# Altium schematic sheet Power Management.SchDoc: Power Management
size 228 x 165 mm; DrawnBy: Joseph Riesen; DocumentNumber: 4; Revision: 1.0; SheetNumber: 4; SheetTotal: 10
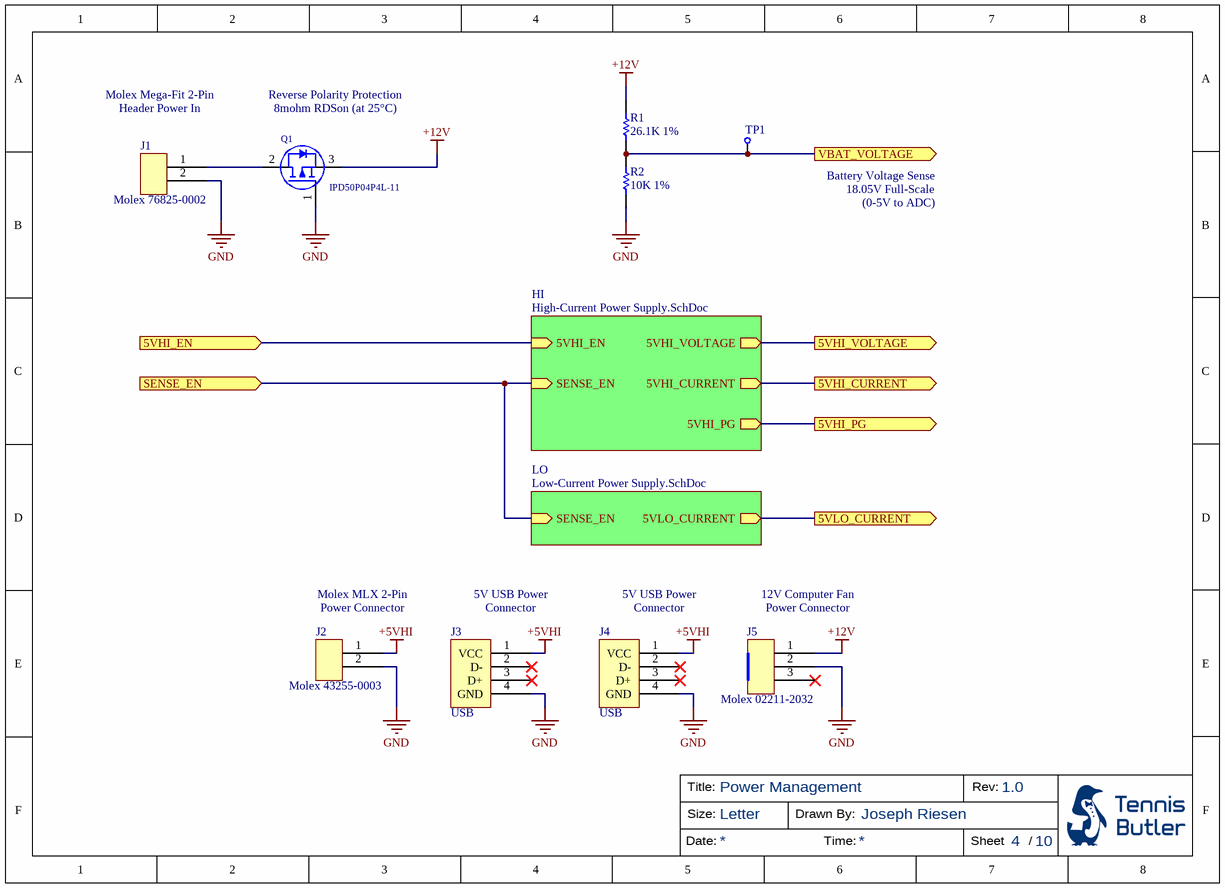
[diagram p0: Power Management.SchDoc]

## Parts
J1  Molex 76825-0002  [MOLEX 76825-0002]
J2  Molex 43255-0003  [Molex 43255-0003]
J3  USB  [Molex 105057-0001]
J4  USB  [Molex 105057-0001]
J5  Molex 02211-2032  [Molex 02211-2032]
Q1  IPD50P04P4L-11  [DPAK228P1000X235-3M]
R1  26.1K 1%  [RESC0805(2012)_M]
R2  10K 1%  [RESC2013X70X40ML20T20]
TP1  VBAT VOLTAGE  [Test Point]  (value not drawn)  (no BOM)

## Sub-sheets
HI = High-Current Power Supply.SchDoc: 5VHI_EN (in), 5VHI_CURRENT (out), SENSE_EN (in), 5VHI_PG (out), 5VHI_VOLTAGE (out)
LO = Low-Current Power Supply.SchDoc: 5VLO_CURRENT (out), SENSE_EN (in)

## Ports
5VHI_CURRENT (out), 5VHI_EN (in), 5VHI_PG (out), 5VHI_VOLTAGE (out), 5VLO_CURRENT (out), SENSE_EN (in), VBAT_VOLTAGE (out)

## Nets
+5VHI: J2.1 J3.1(VCC) J4.1(VCC)
+12V: J5.1 Q1.3 R1.2
GND: J1.2 J2.2 J3.4(GND) J4.4(GND) J5.2 Q1.1 R2.1
5VHI_CURRENT: port 5VHI_CURRENT, sheet HI/5VHI_CURRENT
5VHI_EN: port 5VHI_EN, sheet HI/5VHI_EN
5VHI_PG: port 5VHI_PG, sheet HI/5VHI_PG
5VHI_VOLTAGE: port 5VHI_VOLTAGE, sheet HI/5VHI_VOLTAGE
5VLO_CURRENT: port 5VLO_CURRENT, sheet LO/5VLO_CURRENT
SENSE_EN: port SENSE_EN, sheet HI/SENSE_EN, sheet LO/SENSE_EN
VBAT_VOLTAGE: R1.1 R2.2 TP1.1 ; port VBAT_VOLTAGE
NetJ1_1: J1.1 Q1.2

Not connected (* = marked no-connect by the designer): J3 2(D-)* 3(D+)* 5(GND) 6(GND) 7(GND); J4 2(D-)* 3(D+)* 5(GND) 6(GND) 7(GND); J5 3*

## Notes on the sheet
- (near J1) Molex Mega-Fit 2-Pin
  Header Power In
- (near Q1) Reverse Polarity Protection
  8mohm RDSon (at 25°C)
- Battery Voltage Sense
  18.05V Full-Scale
  (0-5V to ADC)
- (near J2) Molex MLX 2-Pin Power Connector
- (near J3) 5V USB Power Connector
- (near J4) 5V USB Power Connector
- (near J5) 12V Computer Fan Power Connector
- Title:
- Size:
- Letter
- Drawn By:
- Rev:
- Date:
- Time:
- Sheet
- /

## Library data of the parts
J1 = Molex 76825-0002: CONN HEADER R/A 2POS; Number of Circuits: 2; Gender: Male; Pitch: 5.7mm; Supplier 1: Digi-Key; Manufacturer: Molex; Manufacturer Part Number: 76825-0002; Stock 1: 2541; Pricing 1: 1 = 1.13000, 10 = 0.99300, 25 = 0.93440, 50 = 0.89560, 100 = 0.85670, 250 = 0.77880, 500 = 0.70092, 2016 = 0.58410, 4032 = 0.56463 (USD); RoHS: Yes; Color: Black; Contact Plating: Tin; Contact Material: Copper; Termination: Through Hole; Number of Rows: 2; Orientation: Right Angle; Number of Contacts: 2; REACH SVHC: Unknown; ComponentLink1URL: http://www.farnell.com/datasheets/2216551.pdf?src-supplier=Farnell; ComponentLink1Description: Datasheet 1 (Farnell); ComponentLink2URL: http://www.alliedelec.com/images/products/datasheets/bm/BrandonData/70717238.pdf?src-supplier=Allied+Electronics; ComponentLink2Description: Datasheet 2 (Allied Electronics); ComponentLink3URL: https://www.molex.com/pdm_docs/sd/768250002_sd.pdf?src-supplier=Digi-Key; ComponentLink3Description: Datasheet 3 (Digi-Key); ComponentLink4URL: http://www.farnell.com/datasheets/2001779.pdf?src-supplier=Element14; ComponentLink4Description: Datasheet 4 (Element14); ComponentLink5URL: http://www.farnell.com/datasheets/1968956.pdf?src-supplier=Element14; ComponentLink5Description: Datasheet 5 (Element14); Supplier Part Number 1: WM11969-ND
J2 = Molex 43255-0003: Pin & Socket Connectors 0.084 MLX Hdr 2CKT WITH PEG; Current Rating: 20A; Voltage Rating: 600V; Number of Positions: 2; Pitch: 6.35mm; Glow Wire Compliant: Non-compliant; Supplier 1: Digi-Key; Manufacturer: Molex; Manufacturer Part Number: 43255-0003; Stock 1: 7344; Pricing 1: 1 = 0.46000, 10 = 0.43200, 100 = 0.33140, 500 = 0.28820, 1836 = 0.23056, 5508 = 0.20895, 11016 = 0.19454 (USD); RoHS 1: Yes; Mount: Through Hole; Contact Material: Bronze; Contact Plating: Tin; Housing Material: Polyester; Min Operating Temperature: -55°C; Max Operating Temperature: 105°C; Package Quantity: 1836; Number of Rows: 1; Contact Gender: Male; Packaging: Tray; Termination: Through Hole; Number of Contacts: 2; Orientation: Straight; Number of Circuits: 2; REACH SVHC: No SVHC; Flammability Rating: UL94 V-0; ComponentLink1URL: https://datasheet.ciiva.com/30153/7750432550003-pcb-headers-30153428.pdf?src-supplier=Onlinecomponents.com; ComponentLink1Description: Datasheet 1 (Onlinecomponents.com); ComponentLink2URL: https://datasheet.ciiva.com/12919/0432550003-pcb-headers-168374-12919417.pdf?src-supplier=Mouser; ComponentLink2Description: Datasheet 2 (Mouser); Supplier Part Number 1: WM23264-ND
J3 J4 = Molex 105057-0001: CONN RCPT USB2.0 TYPEA 4POS VERT; Manufacturer: Molex; Gender: Receptacle; Number of Ports: 1; Number of Contacts: 4; Current Rating: 1.5A; Voltage Rating: 30V; Pitch: 2mm; Supplier 1: Digi-Key; Manufacturer Part Number: 105057-0001; Stock 1: 43852; Pricing 1: 1 = 1.29000, 10 = 1.13600, 25 = 1.06880, 50 = 1.02440, 100 = 0.97990, 250 = 0.89080, 500 = 0.80172, 2016 = 0.66810, 4032 = 0.64583 (USD); RoHS 1: Yes; Mount: Through Hole; Contact Plating: Gold; Contact Material: Copper Alloy; Number of Terminals: 4; Housing Material: Thermoplastic; Color: Black; Min Operating Temperature: -40°C; Max Operating Temperature: 85°C; Packaging: Tray; Package Quantity: 2016; Connector Type: USB; Termination: Solder; Orientation: Vertical; Features: Shielded; Number of Positions: 4; Number of Circuits: 4; USB Standard: USB 2.0; Length: 14.68mm; Depth: 14.3mm; Radiation Hardening: No; REACH SVHC: Unknown; ComponentLink1URL: https://datasheet.ciiva.com/3094/1050570001-io-connectors-3094352.pdf?src-supplier=Avnet; ComponentLink1Description: https://datasheet.ciiva.com/3094/1050570001-io-connectors-3094352.pdf?src-supplier=Avnet; ComponentLink2URL: https://datasheet.ciiva.com/1098/1598467-1098017.pdf?src-supplier=Element14; ComponentLink2Description: https://datasheet.ciiva.com/1098/1598467-1098017.pdf?src-supplier=Element14; ComponentLink3URL: https://datasheet.ciiva.com/26290/1050570001-io-connectors-26290434.pdf?src-supplier=Onlinecomponents.com; ComponentLink3Description: https://datasheet.ciiva.com/26290/1050570001-io-connectors-26290434.pdf?src-supplier=Onlinecomponents.com; ComponentLink4URL: https://datasheet.ciiva.com/16142/539171050570001-io-nectors-16142942.pdf?src-supplier=Onlinecomponents.com; ComponentLink4Description: https://datasheet.ciiva.com/16142/539171050570001-io-nectors-16142942.pdf?src-supplier=Onlinecomponents.com; ComponentLink5URL: https://datasheet.ciiva.com/15181/getdatasheetpartid-152694-15181206.pdf?src-supplier=Verical; ComponentLink5Description: https://datasheet.ciiva.com/15181/getdatasheetpartid-152694-15181206.pdf?src-supplier=Verical; Supplier Part Number 1: WM8672-ND
J5 = Molex 02211-2032 KK254 3-Pin Polarized Male Header: KK® 254 Solid Header, Vertical, with Friction Lock, 3 Circuits, Gold (Au) Plating; Contact Resistance: 10mR; Number of Positions: 3; Current Rating: 4A; Voltage Rating: 250V; Gender: Male; Insulation Resistance: 50GR; Pitch: 2.54mm; Approvals: UL; Glow Wire Compliant: Non-compliant; Supplier 1: Digi-Key; Manufacturer: Molex; Manufacturer Part Number: 22-11-2032; Stock 1: 54741; Pricing 1: 1 = 0.56000, 10 = 0.52700, 100 = 0.40370, 500 = 0.35100, 1000 = 0.28958, 5000 = 0.25448, 10000 = 0.23693 (USD); RoHS 1: Yes; Mount: Through Hole; Contact Plating: Gold; Contact Material: Brass; Color: White; Housing Color: Black; Housing Material: Nylon; Min Operating Temperature: 0°C; Max Operating Temperature: 75°C; Number of Rows: 1; Packaging: Bulk; Termination: Through Hole; Number of Contacts: 3; Orientation: Straight; Package Quantity: 2000; Max Current Rating: 4A; Number of Circuits: 3; Voltage Rating (DC): 250V; Length: 95mm; Height: 14.68mm; Depth: 9.02mm; Radiation Hardening: No; REACH SVHC: Unknown; Halogen Free: Low Halogen; Lead Free: Lead Free; Flammability Rating: UL94 V-0; ComponentLink1URL: https://datasheet.ciiva.com/5159/0022112032-pcb-headers-158580-5159152.pdf?src-supplier=Mouser; ComponentLink1Description: Datasheet 1 (Mouser); ComponentLink2URL: https://datasheet.ciiva.com/30220/211850022112032-pcb-headers-30220272.pdf?src-supplier=Onlinecomponents.com; ComponentLink2Description: Datasheet 2 (Onlinecomponents.com); ComponentLink3URL: https://datasheet.ciiva.com/16656/0022112032-pcb-headers-16656147.pdf?src-supplier=Avnet+Europe; ComponentLink3Description: Datasheet 3 (Avnet Europe); ComponentLink4URL: https://datasheet.ciiva.com/19462/1966000-19462324.pdf?src-supplier=Jameco; ComponentLink4Description: Datasheet 4 (Jameco); ComponentLink5URL: https://datasheet.ciiva.com/19462/233592-19462460.pdf?src-supplier=Jameco; ComponentLink5Description: Datasheet 5 (Jameco); ComponentLink6URL: https://datasheet.ciiva.com/11746/0900766b80d8f3a3-11746606.pdf?src-supplier=RSComponents; ComponentLink6Description: Datasheet 6 (RSComponents); ComponentLink7URL: https://datasheet.ciiva.com/10090/0022112032-pcb-headers-10090022.pdf?src-supplier=Avnet; ComponentLink7Description: Datasheet 7 (Avnet); ComponentLink8URL: https://datasheet.ciiva.com/28632/1928036-28632682.pdf?src-supplier=Element14; ComponentLink8Description: Datasheet 8 (Element14); Supplier Part Number 1: WM2701-ND
Q1 = IPD50P04P4L-11: MOSFET P-CH 40V 50A TO252-3; Manufacturer: Infineon; Rise Time: 9ns; Drain to Source Voltage (Vdss): -40V; Turn-On Delay Time: 12ns; Turn-Off Delay Time: 46ns; Fall Time: 39ns; Gate to Source Voltage (Vgs): 16V; Input Capacitance: 3.9nF; Rds On Max: 10.6mR; Max Power Dissipation: 58W; Drain to Source Resistance: 17.2mR; Element Configuration: Single; Supplier 1: Digi-Key; Manufacturer Part Number: IPD50P04P4L-11; Stock 1: 23273; Pricing 1: 1 = 1.10000, 10 = 0.97700, 100 = 0.77250, 500 = 0.59910, 1000 = 0.47297 (USD); RoHS 1: Yes; Case/Package: TO-252-3; Number of Pins: 3; Min Operating Temperature: -55°C; Max Operating Temperature: 175°C; Continuous Drain Current (ID): 50A; Package Quantity: 1; Packaging: Tape and Reel; Max Dual Supply Voltage: -40V; Length: 6.5mm; Height: 2.3mm; Width: 6.22mm; Halogen Free: Halogen Free; Lead Free: Lead Free; REACH SVHC: No SVHC; ComponentLink1URL: https://datasheet.ciiva.com/6379/infineon-ipd50p04p4l-11-ds-v01-00-en-6379847.pdf?src-supplier=Digi-Key; ComponentLink1Description: https://datasheet.ciiva.com/6379/infineon-ipd50p04p4l-11-ds-v01-00-en-6379847.pdf?src-supplier=Digi-Key; Supplier Part Number 1: IPD50P04P4L11ATMA1CT-ND
R1 = CMP-1013-00668-1: RES SMD 26.1K OHM 1% 1/8W 0805; Case-Metric: 2012; Power: 0.125 W; Value: 26100.00 Ohm; Case-EIA: 0805; Tolerance: 1 %; Technology: SMT
R2 = CMP-2001-04376-1: RES SMD 10K OHM 1% 1/8W 0805; Manufacturer: Panasonic; Part Number: ERJ-6ENF1002V
TP1 = Test Point